# Altium schematic sheet ADPLV1.1.SchDoc
size B
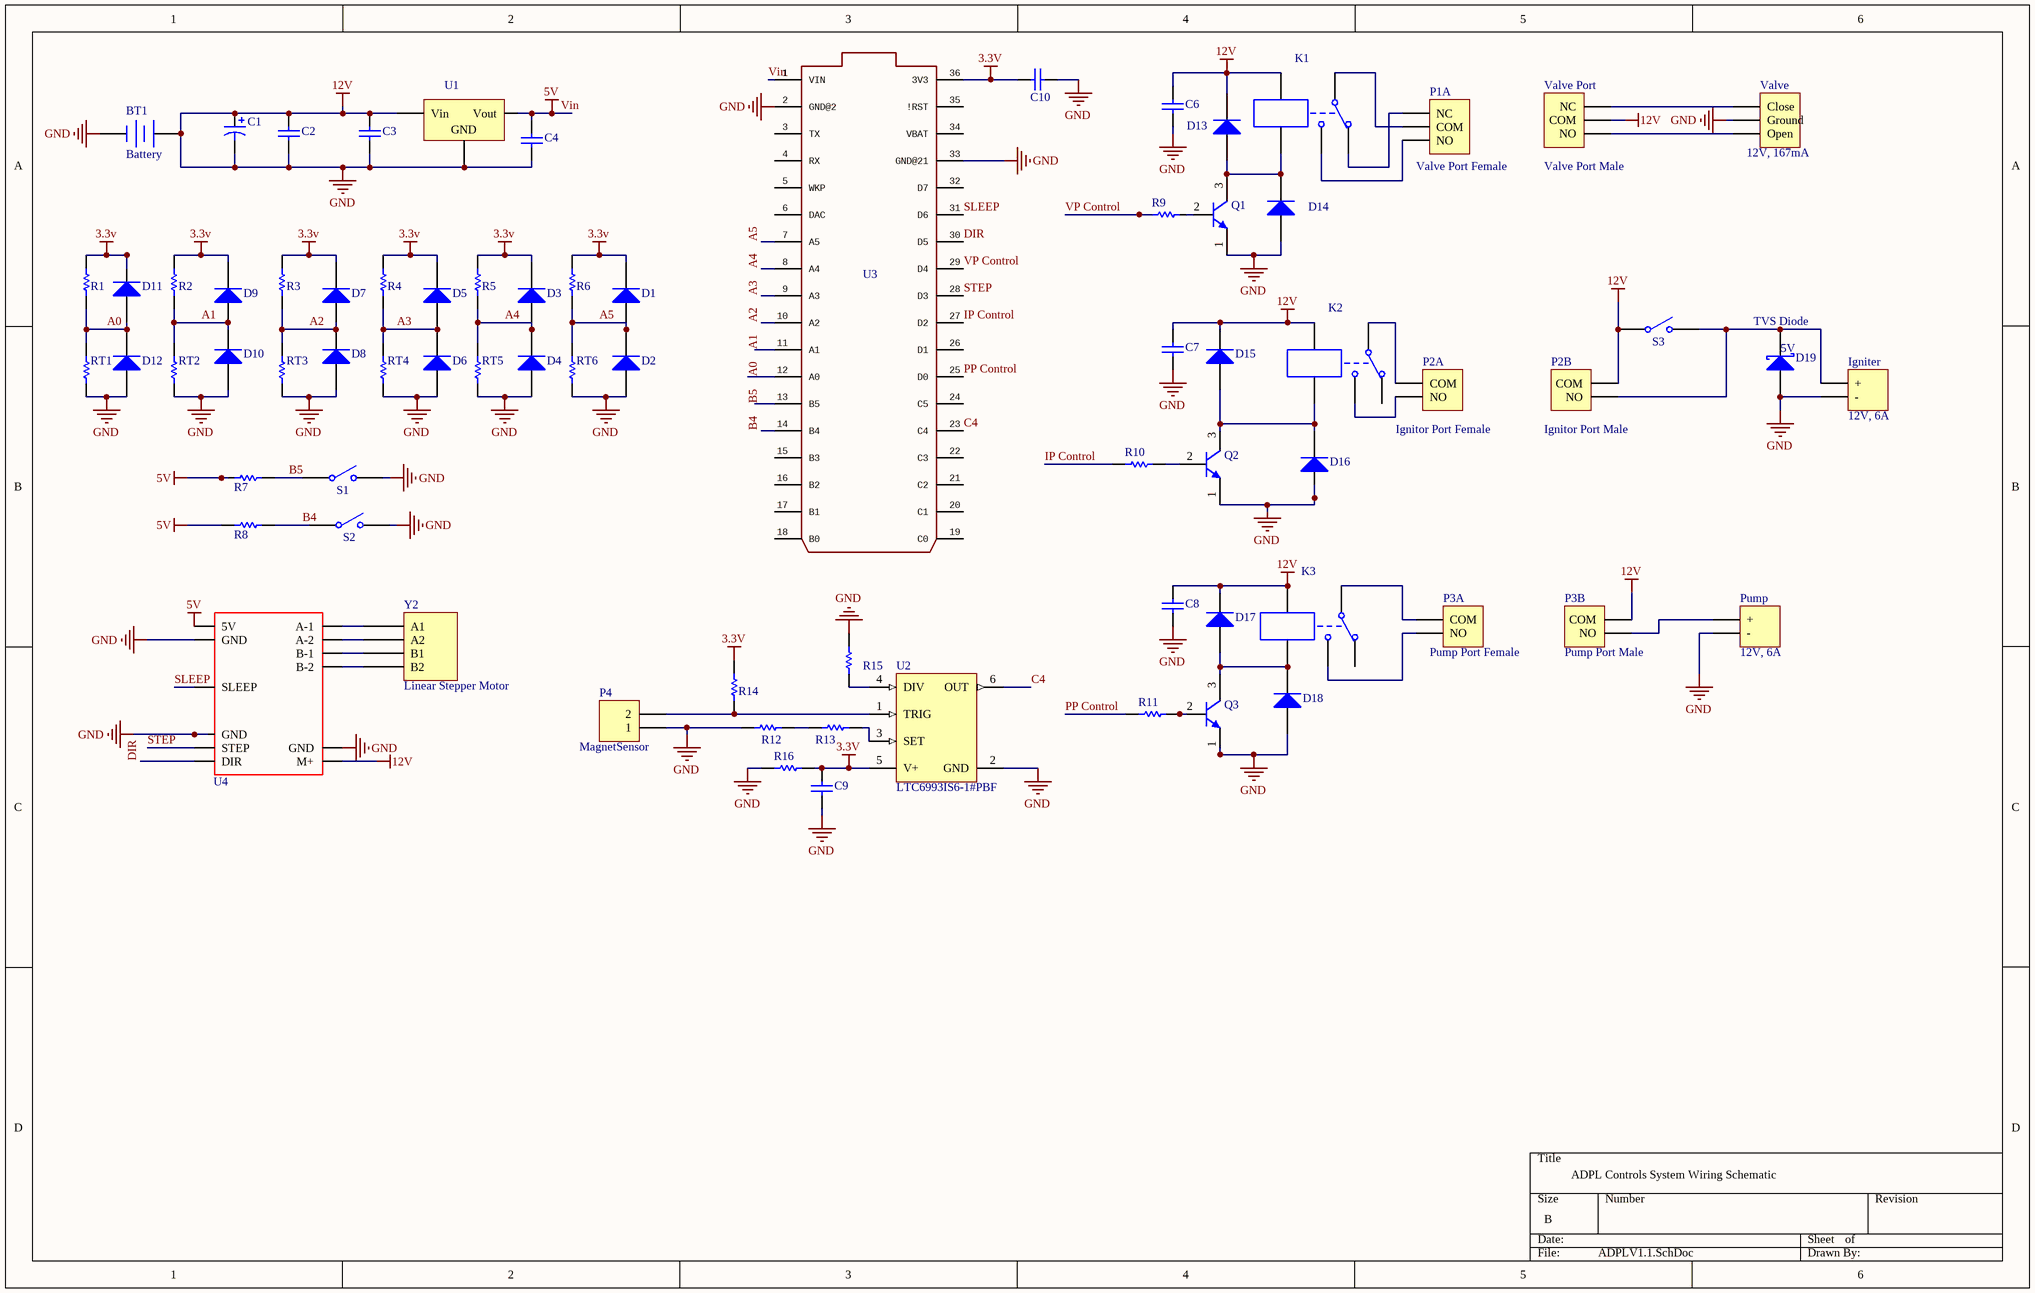
[diagram p0: ADPLV1.1.SchDoc]

## Parts
BT1  Battery
C1  Aluminum Electrolytic Capacitors - Leaded 100uF 25volts 20%  [RB7.6-15]  (value not drawn)
C2  GRM319R71H104KA01D  [CAPC3216X95X55NL15T25]  (value not drawn)
C3  GRM319R71H334KA01D  [CAPC3216X95X55LL15T25]  (value not drawn)
C4  GRM319R71H104KA01D  [CAPC3216X95X55NL15T25]  (value not drawn)
C6  GRM319R71H104KA01D  [CAPC3216X95X55NL15T25]  (value not drawn)
C7  GRM319R71H104KA01D  [CAPC3216X95X55NL15T25]  (value not drawn)
C8  GRM319R71H104KA01D  [CAPC3216X95X55NL15T25]  (value not drawn)
C9  GRM319R71H104KA01D  [CAPC3216X95X55NL15T25]  (value not drawn)
C10  GRM319R71H104KA01D  [CAPC3216X95X55NL15T25]  (value not drawn)
D1  1N914  [DO-35]  (value not drawn)
D2  1N914  [DO-35]  (value not drawn)
D3  1N914  [DO-35]  (value not drawn)
D4  1N914  [DO-35]  (value not drawn)
D5  1N914  [DO-35]  (value not drawn)
D6  1N914  [DO-35]  (value not drawn)
D7  1N914  [DO-35]  (value not drawn)
D8  1N914  [DO-35]  (value not drawn)
D9  1N914  [DO-35]  (value not drawn)
D10  1N914  [DO-35]  (value not drawn)
D11  1N914  [DO-35]  (value not drawn)
D12  1N914  [DO-35]  (value not drawn)
D13  Diode 1N914  [DO-35]  (value not drawn)
D14  Diode 1N914  [DO-35]  (value not drawn)
D15  Diode 1N914  [DO-35]  (value not drawn)
D16  Diode 1N914  [DO-35]  (value not drawn)
D17  Diode 1N914  [DO-35]  (value not drawn)
D18  Diode 1N914  [DO-35]  (value not drawn)
D19  TVS Diode  Working Voltage: 5V  [TO-220AC]
Igniter  12V, 6A  [HDR1X2]
K1  Relay-SPDT  (value not drawn)
K2  Relay-SPDT  (value not drawn)
K3  Relay-SPDT  (value not drawn)
P1A  Valve Port Female
P2A  Ignitor Port Female
P2B  Ignitor Port Male
P3A  Pump Port Female
P3B  Pump Port Male
P4  MagnetSensor  [HDR1X2]
Pump  12V, 6A  [HDR1X2]
Q1  MPSA42  [ONSC-TO-92-3-29-11]  (value not drawn)
Q2  MPSA42  [ONSC-TO-92-3-29-11]  (value not drawn)
Q3  MPSA42  [ONSC-TO-92-3-29-11]  (value not drawn)
R1  RC0805JR-0710KL  [YAGO-RC0805_L]  (value not drawn)
R2  RC0805JR-0710KL  [YAGO-RC0805_L]  (value not drawn)
R3  RC0805JR-0710KL  [YAGO-RC0805_L]  (value not drawn)
R4  RC0805JR-0710KL  [YAGO-RC0805_L]  (value not drawn)
R5  RC0805JR-0710KL  [YAGO-RC0805_L]  (value not drawn)
R6  RC0805JR-0710KL  [YAGO-RC0805_L]  (value not drawn)
R7  RC0805JR-0710KL  [YAGO-RC0805_L]  (value not drawn)
R8  RC0805JR-0710KL  [YAGO-RC0805_L]  (value not drawn)
R9  RC0805JR-071KL  [YAGO-RC0805_L]  (value not drawn)
R10  RC0805JR-071KL  [YAGO-RC0805_L]  (value not drawn)
R11  RC0805JR-071KL  [YAGO-RC0805_L]  (value not drawn)
R12  RC0805JR-07270RL  [YAGO-RC0805_L]  (value not drawn)
R13  RC0805JR-07220RL  [YAGO-RC0805_L]  (value not drawn)
R14  RC0805JR-0710KL  [YAGO-RC0805_L]  (value not drawn)
R15  RC0805JR-07680RL  [YAGO-RC0805_L]  (value not drawn)
R16  RC0805JR-071KL  [YAGO-RC0805_L]  (value not drawn)
RT1  I2-1B062  (value not drawn)
RT2  NTCAIMME3C90373  (value not drawn)
RT3  NTCAIMME3C90373  (value not drawn)
RT4  NTCAIMME3C90373  (value not drawn)
RT5  NTCAIMME3C90373  (value not drawn)
RT6  NTCAIMME3C90373  (value not drawn)
S1  SW-SPST  (value not drawn)
S2  SW-SPST  (value not drawn)
S3  SW-SPST  (value not drawn)
U1  REGULATOR SW SYNC 5V 2A SIP  (value not drawn)
U2  LTC6993IS6-1#PBF  [LT-S6-6-TSOT-23_M]
U3  Particle Electron  (value not drawn)
U4  105990027  (value not drawn)
Valve  12V, 167mA  [HDR1X3]
Valve_Port  Valve Port Male
Y2  Linear Stepper Motor

## Nets
3.3v: C9.2 C10.2 D1.2(K) D3.2(K) D5.2(K) D7.2(K) D9.2(K) D11.2(K) R1.2 R2.2 R3.2 R4.2 R5.2 R6.2 R14.2 R16.2 U2.5(V+) U3.36(3V3)
12V: BT1.1(+) BT1.2(-) C1.1 C1.2 C2.1 C2.2 C3.1 C3.2 C4.1 C6.1 C6.2 C7.1 C7.2 C8.1 C8.2 C9.1 C10.1 D2.1(A) D4.1(A) D6.1(A) D8.1(A) D10.1(A) D12.1(A) D13.2(K) D14.1(A) D15.2(K) D16.1(A) D17.2(K) D18.1(A) D19.3(A) Igniter.2(-) K1.4 K2.4 K3.4 P2B.2(COM) P3B.2(COM) P4.1 Pump.2(-) Q1.1(E) Q2.1(E) Q3.1(E) R12.1 R15.2 R16.1 RT1.1 RT2.1 RT3.1 RT4.1 RT5.1 RT6.1 S1.2(NO) S2.2(NO) S3.1(COMMON) U1.1(Vin) U1.2(GND) U2.2(GND) U3.2(GND@2) U3.33(GND@21) U4.?1(GND) U4.?6(GND) U4.?7(M+) U4.?8(GND) Valve.2(Ground) Valve_Port.2(COM)  [also labelled GND]
Vin: C4.2 R7.2 R8.2 U1.3(Vout) U3.1(VIN) U4.?5(5V)  [also labelled 5V]
A0: D11.1(A) D12.2(K) R1.1 RT1.2 U3.12(A0)
A1: D9.1(A) D10.2(K) R2.1 RT2.2 U3.11(A1)
A2: D7.1(A) D8.2(K) R3.1 RT3.2 U3.10(A2)
A3: D5.1(A) D6.2(K) R4.1 RT4.2 U3.9(A3)
A4: D3.1(A) D4.2(K) R5.1 RT5.2 U3.8(A4)
A5: D1.1(A) D2.2(K) R6.1 RT6.2 U3.7(A5)
B4: R8.1 S2.1(COMMON) U3.14(B4)
B5: R7.1 S1.1(COMMON) U3.13(B5)
C4: U2.6(OUT) U3.23(C4)
DIR: U3.30(D5) U4.?3(DIR)
IP Control: R10.1 U3.27(D2)
PP Control: R11.1 U3.25(D0)
SLEEP: U3.31(D6) U4.?4(SLEEP)
STEP: U3.28(D3) U4.?2(STEP)
VP Control: R9.1 U3.29(D4)
NetD13_1: D13.1(A) D14.2(K) K1.5 Q1.3(C)
NetD15_1: D15.1(A) D16.2(K) K2.5 Q2.3(C)
NetD17_1: D17.1(A) D18.2(K) K3.5 Q3.3(C)
NetD19_1: D19.1(K) Igniter.1(+) P2B.1(NO) S3.2(NO)
NetK1_1: K1.1 P1A.2(COM)
NetK1_2: K1.2 P1A.1(NC)
NetK1_3: K1.3 P1A.3(NO)
NetK2_1: K2.1 P2A.1(COM)
NetK2_3: K2.3 P2A.2(NO)
NetK3_1: K3.1 P3A.1(COM)
NetK3_3: K3.3 P3A.2(NO)
NetP3B_1: P3B.1(NO) Pump.1(+)
NetP4_2: P4.2 R14.1 U2.1(TRIG)
NetQ1_2: Q1.2(B) R9.2
NetQ2_2: Q2.2(B) R10.2
NetQ3_2: Q3.2(B) R11.2
NetR12_2: R12.2 R13.1
NetR13_2: R13.2 U2.3(SET)
NetR15_1: R15.1 U2.4(DIV)
NetU4_?9: U4.?9(A-1) Y2.A1
NetU4_?10: U4.?10(A-2) Y2.A2
NetU4_?11: U4.?11(B-1) Y2.B1
NetU4_?12: U4.?12(B-2) Y2.B2
NetValve_1: Valve.1(Close) Valve_Port.3(NC)
NetValve_3: Valve.3(Open) Valve_Port.1(NO)

Not connected (* = marked no-connect by the designer): K2 2; K3 2; U3 3(TX) 4(RX) 5(WKP) 6(DAC) 15(B3) 16(B2) 17(B1) 18(B0) 19(C0) 20(C1) 21(C2) 22(C3) 24(C5) 26(D1) 32(D7) 34(VBAT) 35(!RST)

## Notes on the sheet
- ADPL Controls System Wiring Schematic

## Library data of the parts
BT1 = Battery: Multicell Battery; Power Rating: 30 Ah; LatestRevisionDate: 17-Jul-2002; LatestRevisionNote: Re-released for DXP Platform.; Publisher: Altium Limited; Published: 24-Mar-1999; PackageReference: BAT-2; PackageDescription: Battery; 2 Leads
C1 = Cap Pol1: Polarized Capacitor (Radial); Voltage Rating: 25V; Published: 8-Jun-2000; LatestRevisionDate: 17-Jul-2002; LatestRevisionNote: Re-released for DXP Platform.; PackageReference: RB7.6-15; Publisher: Altium Limited; PackageDescription: Polarized Capacitor (Radial); 2 Leads; Value: 100uF; Tolerance: 20 %
C2 C4 C6-C10 = CMP-1662-00007-4: Chip Capacitor, 0.1 uF, +/- 10%, 50 V, -55 to 125 degC, 1206 (3216 Metric), RoHS, Tape and Reel; Manufacturer: Murata; Voltage Rating: 50 V; Lead Pitch: 4 mm; PackageDescription: 2-Pin Surface Mount Device, Body 3.2 x 1.6 mm; DatasheetVersion: 03/2016; Min Operating Temperature: -55 degC; Package Quantity: 4000; RoHSCompliant: true; Max Operating Temperature: 125 degC; Height: 0.85 mm; Pins: 2; Length: 3.2 mm; PackageReference: 1206 (3216 Metric); Mounting Technology: Surface Mount; ComponentLink1Description: Manufacturer URL; ComponentLink2Description: Datasheet; ComponentLink1URL: http://www.murata.com/; Mount: Surface Mount; REACH SVHC: No SVHC; Packaging: Tape and Reel; ComponentLink2URL: http://search.murata.co.jp/Ceramy/image/img/A01X/G101/ENG/GRM319R71H104KA01-01.pdf
C3 = CMP-1662-00007-4: CAP CER 0.33UF 50V X7R 1206; Manufacturer: Murata; PackageDescription: 2-Pin Surface Mount Device, Body 3.2 x 1.6 mm; DatasheetVersion: 03/2016; Min Operating Temperature: -55 degC; Package Quantity: 4000; RoHSCompliant: true; Max Operating Temperature: 125 degC; Voltage Rating: 50 V; Pins: 2; PackageReference: 1206 (3216 Metric); Mounting Technology: Surface Mount; ComponentLink1Description: Manufacturer URL; ComponentLink2Description: Datasheet; ComponentLink1URL: http://www.murata.com/; Mount: Surface Mount; REACH SVHC: No SVHC; Packaging: Cut Tape; ComponentLink2URL: http://www.digikey.com/product-detail/en/murata-electronics-north-america/GRM319R71H334KA01D/490-1778-1-ND/587531
D1-D18 = Diode 1N914: High Conductance Fast Diode; Published: 8-Jun-2000; LatestRevisionDate: 17-Jul-2002; LatestRevisionNote: Re-released for DXP Platform.; DatasheetVersion: 1997; PackageReference: DO-35; Publisher: Altium Limited; PackageDescription: Diode, Axial; Body 3.8 x 1.9 mm (LxDia. max), Lead Dia. 0.53 mm (max); Code_JEDEC: DO-204-AH; ComponentLink1Description: Manufacturer Link; ComponentLink1URL: http://www.fairchildsemi.com/; ComponentLink2Description: Datasheet; ComponentLink2URL: http://www.fairchildsemi.com/ds/1N%2F1N4448.pdf
D19 = Diode 10TQ040: TVS Diode - Birectional; Part#: SA5.0CA; Note: Terminal 2 is the TAB and is electrically connected to the cathode; Clamping voltage: 9.6V; Published: 8-Jun-2000; LatestRevisionDate: 17-Jul-2002; LatestRevisionNote: Re-released for DXP Platform.; DatasheetVersion: PD-2.057B; PackageVersion: Feb-1998; PackageReference: TO-220AC; Publisher: Altium Limited; PackageDescription: TO, Thru-Hole, Vertical, Heatsink Mounted; 3 In-Line Leads (1 Absent); Pitch 2.54 mm; ComponentLink1Description: Manufacturer Link; ComponentLink1URL: http://www.irf.com/
Igniter Pump = Header 2: Header, 2-Pin; Input: 1.5VDC, 280-320mA; LatestRevisionDate: 17-Jul-2002; LatestRevisionNote: Re-released for DXP Platform.; Publisher: Altium Limited
K1-K3 = Relay-SPDT: Single-Pole Dual-Throw Relay; Part Number: SRD12SLA; Contact Capacity: 10A; Inductive Load: 5A; Published: 24-Mar-1999; LatestRevisionDate: 17-Jul-2002; LatestRevisionNote: Re-released for DXP Platform.; PackageReference: MODULE5B; Publisher: Altium Limited
P1A Valve = Header 3: Header, 3-Pin; Part#: CWX-15Q, CR-02; LatestRevisionDate: 17-Jul-2002; LatestRevisionNote: Re-released for DXP Platform.; Publisher: Altium Limited
P2A = Header 2: Header, 2-Pin; Aaron's Comment: 1.5V, 280-320mA; LatestRevisionDate: 17-Jul-2002; LatestRevisionNote: Re-released for DXP Platform.; Publisher: Altium Limited
P2B P3B = Header 2: LatestRevisionDate: 17-Jul-2002; LatestRevisionNote: Re-released for DXP Platform.; Publisher: Altium Limited
P3A = Header 2: Header, 2-Pin; Aaron's Comment: 12V, 6A; LatestRevisionDate: 17-Jul-2002; LatestRevisionNote: Re-released for DXP Platform.; Publisher: Altium Limited
P4 = Header 2: Header, 2-Pin; Resistance: Contact on maximum resistance: ≤10kΩ   Open contact minimum resistance: ≥500kΩ; LatestRevisionDate: 17-Jul-2002; LatestRevisionNote: Re-released for DXP Platform.; Publisher: Altium Limited; Source: http://www.amazon.com/GERI-Counter-Digital-Proximity-Magnetic/dp/B01875612U/ref=sr_1_2?ie=UTF8&qid=1456764906&sr=8-2&keywords=magnetic+counter
Q1-Q3 = CMP-1048-01390-1: High Voltage Transistor, NPN Silicon, 3-Pin TO-92, Bulk Box; Manufacturer: On Semiconductor; fT Min (MHz): 50; Note1: 0; IC Continuous (A): 0.5; ComponentLink3Description: Package Specification; PackageReference: TO-92-3-29-11_AM_SL; Packing: Bulk Box; ComponentLink1URL: http://www.onsemi.com/; PackageDescription: 3-Pin Transistor Outline, Body 4.825 x 3.685 mm, Pitch 1.27 mm; Mounting Technology: Through Hole; RoHS: FALSE; DatasheetVersion: Rev. 8; PackageVersion: Rev. AM; ComponentLink2Description: Datasheet; ComponentLink1Description: Manufacturer URL; ComponentLink2URL: http://www.onsemi.cn/pub_link/Collateral/MPSA42-D.PDF; ComponentLink3URL: http://www.onsemi.cn/pub_link/Collateral/2N6426-D.PDF; Polarity: NPN; PartNumber: MPSA42
R1-R8 R14 = CMP-1568-00001-1: RES SMD 10K OHM 5% 1/8W 0805; Packing: CT; Power: 0.125 W; PackageDescription: 2-Pin Surface Mount Device, Body 2 x 1.25 mm; Tolerance: ±5%; ComponentLink2URL: http://www.yageo.com/documents/recent/PYu-RC_Group_51_RoHS_L-3.pdf; Temperature Min: -55 degC; Mounting Technology: Surface Mount; PartNumber: RC0805JR-0710KL; ComponentLink1URL: http://www.yageo.com/NewPortal/_en/index.jsp; Resistance: 10k; Temperature Max: 155 degC; ComponentLink2Description: Datasheet; DatasheetVersion: Rev. 3; RoHS: TRUE; ComponentLink1Description: Manufacturer URL
R9-R11 R16 = CMP-1568-00001-1: RES SMD 1K OHM 5% 1/8W 0805; PartNumber: RC0805FR-074K7L; Packing: Tape and Reel; Power: 0.125 W; PackageDescription: 2-Pin Surface Mount Device, Body 2 x 1.25 mm; Tolerance: ±5%; ComponentLink2URL: http://www.yageo.com/documents/recent/PYu-RC_Group_51_RoHS_L-3.pdf; Temperature Min: -55 degC; Mounting Technology: Surface Mount; ComponentLink1URL: http://www.yageo.com/NewPortal/_en/index.jsp; Resistance: 1k; Temperature Max: 155 degC; ComponentLink2Description: Datasheet; DatasheetVersion: Rev. 3; RoHS: TRUE; ComponentLink1Description: Manufacturer URL
R12 = CMP-1568-00001-1: RES SMD 270 OHM 5% 1/8W 0805; Packing: CT; Power: 0.125 W; Resistance: 270; PackageDescription: 2-Pin Surface Mount Device, Body 2 x 1.25 mm; Tolerance: ±5%; ComponentLink2URL: http://www.yageo.com/documents/recent/PYu-RC_Group_51_RoHS_L-3.pdf; Temperature Min: -55 degC; Mounting Technology: Surface Mount; PartNumber: RC0805JR-07270RL; ComponentLink1URL: http://www.yageo.com/NewPortal/_en/index.jsp; Temperature Max: 155 degC; ComponentLink2Description: Datasheet; DatasheetVersion: Rev. 3; RoHS: TRUE; ComponentLink1Description: Manufacturer URL
R13 = CMP-1568-00001-1: RES SMD 220 OHM 5% 1/8W 0805; Packing: CT; Power: 0.125 W; Resistance: 220; PackageDescription: 2-Pin Surface Mount Device, Body 2 x 1.25 mm; Tolerance: ±5%; ComponentLink2URL: http://www.yageo.com/documents/recent/PYu-RC_Group_51_RoHS_L-3.pdf; Temperature Min: -55 degC; Mounting Technology: Surface Mount; PartNumber: RC0805JR-07220RL; ComponentLink1URL: http://www.yageo.com/NewPortal/_en/index.jsp; Temperature Max: 155 degC; ComponentLink2Description: Datasheet; DatasheetVersion: Rev. 3; RoHS: TRUE; ComponentLink1Description: Manufacturer URL
R15 = CMP-1568-00001-1: RES SMD 680 OHM 5% 1/8W 0805; PartNumber: RC0805FR-074K7L; Packing: Cut Tape (CT); Power: 0.125 W; Resistance: 680; PackageDescription: 2-Pin Surface Mount Device, Body 2 x 1.25 mm; Tolerance: ±5%; ComponentLink2URL: http://www.yageo.com/documents/recent/PYu-RC_Group_51_RoHS_L-3.pdf; Temperature Min: -55 degC; Mounting Technology: Surface Mount; ComponentLink1URL: http://www.yageo.com/NewPortal/_en/index.jsp; Temperature Max: 155 degC; ComponentLink2Description: Datasheet; DatasheetVersion: Rev. 3; RoHS: TRUE; ComponentLink1Description: Manufacturer URL
RT1 = Res1: Immersion temperature sensor, 6" insertion length, 10K Ω NTC Type 3 Thermistor.; Part#: NTCAIMME3C90373; Accuracy: ±0.36°F from 32 to 158°F (0 to 70°C); Probe Diameter: 1/4" (6.3 mm); Cable Length: 6' (1.8 m); Published: 8-Jun-2000; LatestRevisionDate: 17-Jul-2002; LatestRevisionNote: Re-released for DXP Platform.; PackageReference: AXIAL-0.3; Publisher: Altium Limited; PackageDescription: Axial Device, Thru-Hole; 2 Leads; 0.3 in Pin Spacing; Value: 10K; Drawing: http://www.dwyer-inst.com/images/I2-1_DD.pdf; Operating Temperature: -32 to 240°F (-35.5 to 115.5°C); Link2Component: http://www.dwyer-inst.com/Product/Temperature/Sensors/SeriesI2-1#ordering
RT2-RT6 = Res1: Resistor; Value: 10K; Power Rating: 100 mW; Tolerance: 3 %; Published: 8-Jun-2000; LatestRevisionDate: 17-Jul-2002; LatestRevisionNote: Re-released for DXP Platform.; PackageReference: AXIAL-0.3; Publisher: Altium Limited; PackageDescription: Axial Device, Thru-Hole; 2 Leads; 0.3 in Pin Spacing; Part#: NTCAIMME3C90373; Termination Style: Wire Lead; Operating Temperature Range: - 25 C to + 105 C; Datasheet: http://www.mouser.com/ds/2/427/ntcaimme3c90373-211357.pdf
S1-S3 = SW-SPST: SWITCH PUSH SPST-NO 0.1A 35V; Manufacturer Part Number: 1.14002.1110000; Current Rating: 100mA (DC); Published: 24-Mar-1999; LatestRevisionDate: 17-Jul-2002; LatestRevisionNote: Re-released for DXP Platform.; PackageReference: SPST-2; Publisher: Altium Limited; PackageDescription: Switch; 2 Leads; Digi-Key Part Number: 1715-1675-1-ND; Voltage Rating - DC: 35V; Mounting Type: Surface Mount; Link: http://www.digikey.com/product-detail/en/rafi-usa/1.14002.1110000/1715-1675-1-ND/2815589; Datasheet: http://www.digikey.com/product-detail/en/rafi-usa/1.14002.1110000/1715-1675-1-ND/2815589
U1 = Volt Reg: Voltage Regulator; Part#: 78SR-5/2-C; Voltage input: 8V-32V; Current output: 2.0A; Published: 24-Mar-1999; LatestRevisionDate: 29-May-2009; LatestRevisionNote: IPC-7351 Footprint Added.; PackageReference: D2PAK; Publisher: Altium Limited; PackageDescription: Non-Isolated PoL Module DC DC Converter 1 Output 5V 2A 8V - 32V Input; Voltage output: 5V; Manufacturer Part Number: 78SR-5/2-C; Datasheet: http://power.murata.com/data/power/mpm_78sr-2a_a00.pdf
U2 = CMP-1335-00063-1: TimerBlox: Monostable Pulse Generator (One Shot), 2.25 to 5.5 V, -40 to 85 degC, 6-Pin TSOT-23 (S6), RoHS; Manufacturer: Linear Technology; RSET: 800 KOhm Max.; VSET: 0.97 to 1.03 V; tWIDTH: 5 ns Typ.; Mounting Technology: Surface Mount; ComponentLink2URL: http://cds.linear.com/docs/en/datasheet/69931234fb.pdf; ComponentLink1URL: http://www.linear.com/; RoHS: TRUE; PartNumber: LTC6993IS6-1#PBF; Temperature Range: -40 to 85 degC; ComponentLink3Description: Package Specification; DatasheetVersion: Rev. B; PackageDescription: 6-Pin Small Out-Line Transistor, Body 2.9 x 1.625 mm, Pitch 0.95 mm; ComponentLink2Description: Datasheet; V+: 2.25 to 5.5 V; PackageVersion: Jun-10; ComponentLink3URL: http://cds.linear.com/docs/en/packaging/SOT_6_05-08-1636.pdf; ComponentLink1Description: Manufacturer URL
U3 = ELECTRON_WITH_HEADERS
U4 = EasyDriver: EASY DRIVER STEPPER MOTOR DRIVER; Manufacturer: Seeed Technology Co.; Expanded Description: A3967 - Power Management, Motor Control, Stepper Evaluation Board; Mounting Technology: Header; PartNumber: 105990027; DigiKey Part #: 1597-1403-ND
Valve_Port = Header 3: Header, 3-Pin; Part#: CWX-15Q, CR-02; Aaron's Comment: 12V, 167 mA; LatestRevisionDate: 17-Jul-2002; LatestRevisionNote: Re-released for DXP Platform.; Publisher: Altium Limited
Y2 = Nema Non-captive Linear Stepper Motor: This is a linear stepper motor which named Nema 23 Non-captive linear actuator, it was composed of 56mm 2A Nema 23 stepper motor and 150mm length Tr11x2 linear screw.; Part Number: 23LS22-2004N-150T; Rated Current: 2.0A; 24-36V: Recommended Voltage; ComponentLink1Description: Manufacturer URL; ComponentLink2URL: http://industrial.panasonic.com/www-data/pdf/AEA5000/AEA5000CE4.pdf; ComponentLink2Description: Datasheet; ComponentLink1URL: http://www.omc-stepperonline.com/nema-23-noncaptive-linear-stepper-motor-56mm-body-150mm-lead-screw-t11-x-2-p-150.html